# EAGLE design gerbang fix (EAGLE 6.6.0)
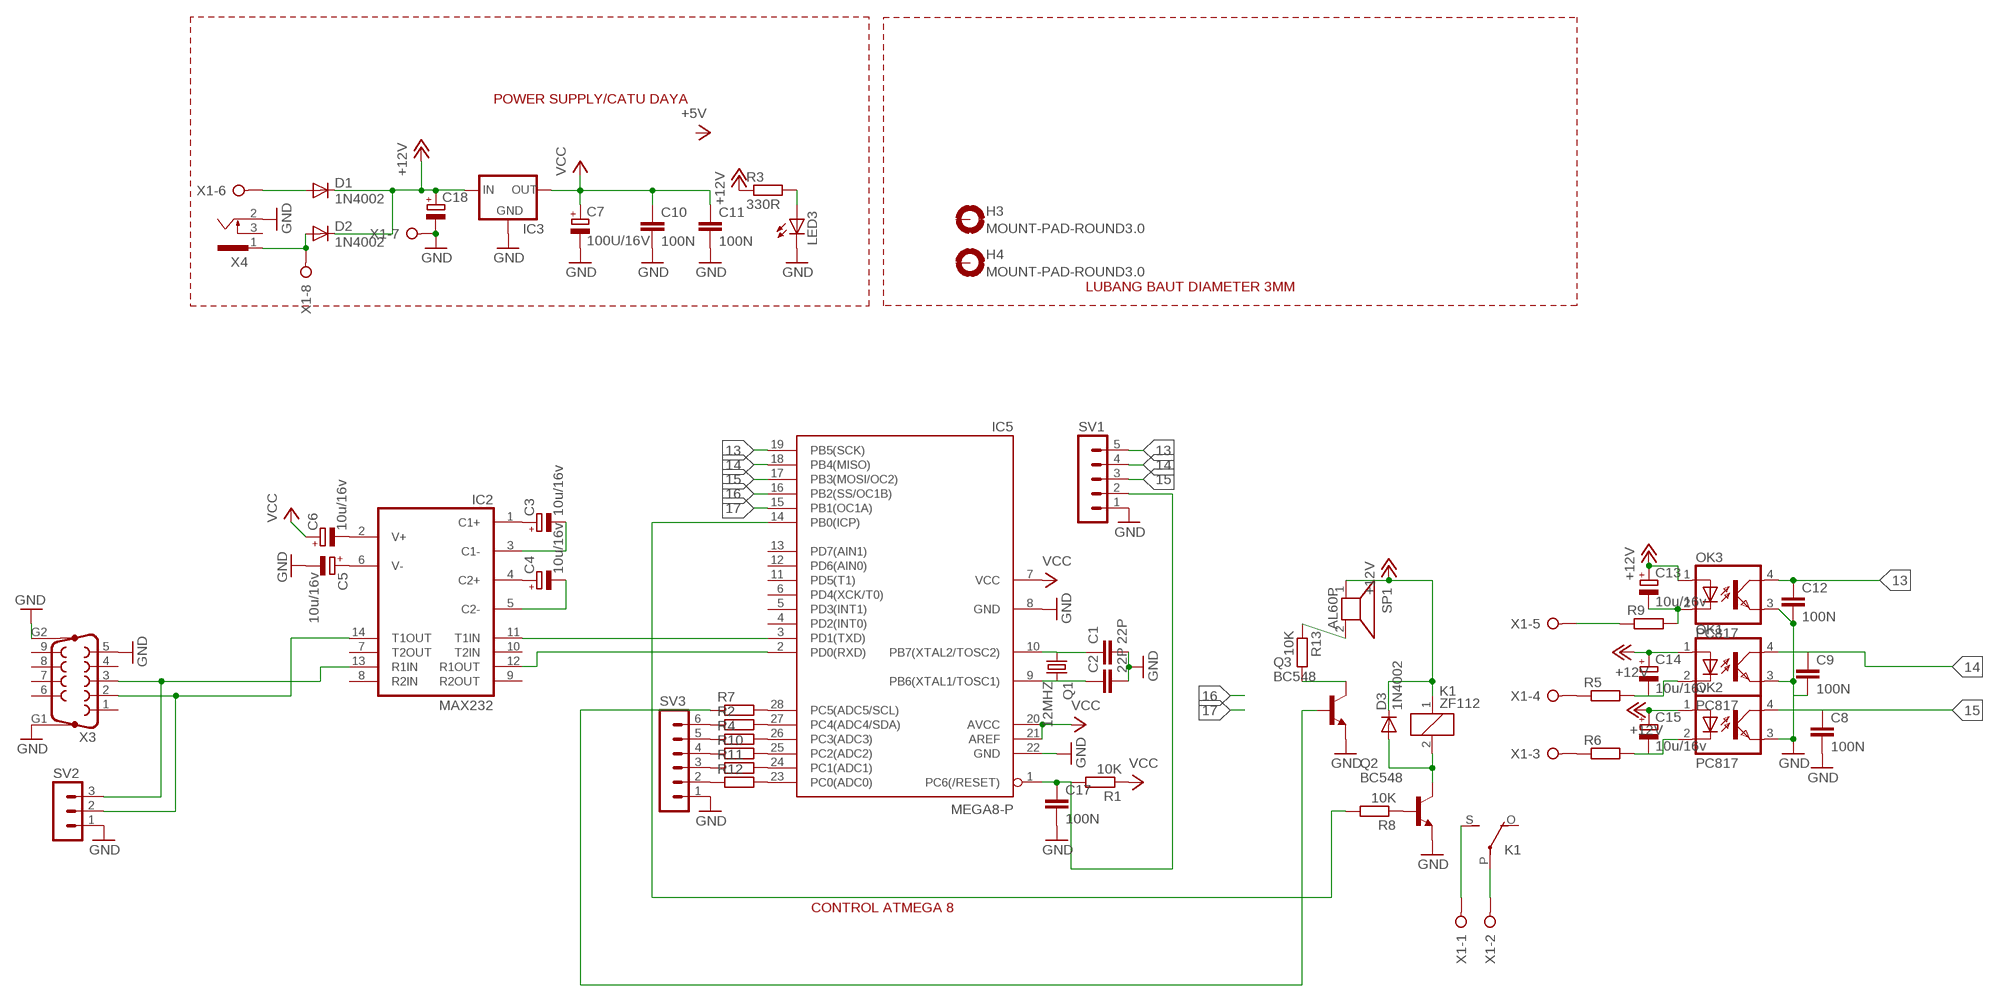
[diagram p0: schematic, sheet 1]

## Parts
C1  22P  C-EU025-025X050  [C025-025X050]
C2  22P  C-EU025-025X050  [C025-025X050]
C3  10u/16v  CPOL-EUE2.5-6  [E2,5-6]
C4  10u/16v  CPOL-EUE2.5-6  [E2,5-6]
C5  10u/16v  CPOL-EUE2.5-6  [E2,5-6]
C6  10u/16v  CPOL-EUE2.5-6  [E2,5-6]
C7  100U/16V  CPOL-EUE2.5-6  [E2,5-6]
C8  100N  C-EU025-025X050  [C025-025X050]
C9  100N  C-EU025-025X050  [C025-025X050]
C10  100N  C-EU025-025X050  [C025-025X050]
C11  100N  C-EU025-025X050  [C025-025X050]
C12  100N  C-EU025-025X050  [C025-025X050]
C13  10u/16v  CPOL-EUE2.5-6  [E2,5-6]
C14  10u/16v  CPOL-EUE2.5-6  [E2,5-6]
C15  10u/16v  CPOL-EUE2.5-6  [E2,5-6]
C17  100N  C-EU025-025X050  [C025-025X050]
C18  CPOL-EUE5-8.5  [E5-8,5]
D1  1N4002  1N4148DO35-10  [DO35-10]
D2  1N4002  1N4148DO35-10  [DO35-10]
D3  1N4002  1N4148DO35-10  [DO35-10]
H3  MOUNT-PAD-ROUND3.0  [3,0-PAD]
H4  MOUNT-PAD-ROUND3.0  [3,0-PAD]
IC2  MAX232  [DIL16]
IC3  78XXS  [78XXS]
IC5  MEGA8-P  [DIL28-3]
K1  ZF112  [ZF112]
LED3  LED5MM  [LED5MM]
OK1  PC817  [DIL04]
OK2  PC817  [DIL04]
OK3  PC817  [DIL04]
Q1  12MHZ  CRYSTALHC49U-V  [HC49U-V]
Q2  BC548  [TO92-EBC]
Q3  BC548  [TO92-EBC]
R1  10K  R-EU_0207/10  [0207/10]
R2  R-EU_0204/2V  [0204V]
R3  330R  R-EU_0207/10  [0207/10]
R4  R-EU_0204/2V  [0204V]
R5  R-EU_0204/2V  [0204V]
R6  R-EU_0204/2V  [0204V]
R7  R-EU_0204/2V  [0204V]
R8  10K  R-EU_0207/10  [0207/10]
R9  R-EU_0204/2V  [0204V]
R10  R-EU_0204/2V  [0204V]
R11  R-EU_0204/2V  [0204V]
R12  R-EU_0204/2V  [0204V]
R13  10K  R-EU_0207/10  [0207/10]
SP1  AL60P  [AL60P]
SV1  MA05-1  [MA05-1]
SV2  MA03-1  [MA03-1]
SV3  MA06-1  [MA06-1]
X1  W237-08P  [W237-8P]
X3  F09HP  [F09HP]
X4  733980-62  [733980-62]

## Nets
13: C12.1 IC5.19(PB5(SCK)) OK3.4(COL) SV1.5
14: C9.1 IC5.18(PB4(MISO)) OK1.4(COL) SV1.4
15: C8.1 IC5.17(PB3(MOSI/OC2)) OK2.4(COL) SV1.3
16: IC5.16(PB2(SS/OC1B))
17: IC5.15(PB1(OC1A))
+12V: C13.+ C14.+ C15.+ C18.+ D1.C D2.C D3.C IC3.IN K1.1 OK1.1(A) OK2.1(A) OK3.1(A) R3.1 SP1.1
GND: C1.2 C2.2 C5.- C7.- C8.2 C9.2 C10.2 C11.2 C12.2 C17.2 C18.- IC3.GND IC5.8(GND) IC5.22(GND) LED3.K(C) OK1.3(EMIT) OK2.3(EMIT) OK3.3(EMIT) Q2.E Q3.E SV1.1 SV2.1 SV3.1 X1.7 X3.5 X3.G1 X3.G2 X4.2
N$1: C17.1 IC5.1(PC6(/RESET)) R1.2 SV1.2
N$2: Q3.C R13.2
N$3: Q3.B R7.1
N$4: IC5.14(PB0(ICP)) R8.2
N$5: R13.1 SP1.2
N$8: R9.1 X1.5
N$9: D1.A X1.6
N$10: IC2.12(R1OUT) IC5.2(PD0(RXD))
N$11: IC2.11(T1IN) IC5.3(PD1(TXD))
N$12: C2.1 IC5.9(PB6(XTAL1/TOSC1)) Q1.2
N$13: C1.1 IC5.10(PB7(XTAL2/TOSC2)) Q1.1
N$14: LED3.A R3.2
N$15: R5.1 X1.4
N$16: C3.+ IC2.1(C1+)
N$17: C3.- IC2.3(C1-)
N$19: D2.A X1.8 X4.1
N$20: IC5.27(PC4(ADC4/SDA)) R2.2
N$21: R6.1 X1.3
N$22: C4.+ IC2.4(C2+)
N$23: C4.- IC2.5(C2-)
N$24: C5.+ IC2.6(V-)
N$25: C6.- IC2.2(V+)
N$26: IC2.13(R1IN) SV2.3 X3.3
N$27: IC2.14(T1OUT) SV2.2 X3.2
N$28: IC5.28(PC5(ADC5/SCL)) R7.2
N$29: K1.S(2:S) X1.1
N$30: K1.P(2:P) X1.2
N$31: C13.- OK3.2(C) R9.2
N$32: C14.- OK1.2(C) R5.2
N$33: C15.- OK2.2(C) R6.2
N$34: D3.A K1.2 Q2.C
N$35: IC5.26(PC3(ADC3)) R4.2
N$36: Q2.B R8.1
N$37: IC5.25(PC2(ADC2)) R10.2
N$38: IC5.24(PC1(ADC1)) R11.2
N$39: IC5.23(PC0(ADC0)) R12.2
N$40: R2.1 SV3.6
N$41: R4.1 SV3.5
N$42: R10.1 SV3.4
N$43: R11.1 SV3.3
N$44: R12.1 SV3.2
VCC: C6.+ C7.+ C10.1 C11.1 IC3.OUT IC5.7(VCC) IC5.20(AVCC) IC5.21(AREF) R1.1
Unconnected: H3.B3,0(MOUNT) H4.B3,0(MOUNT) IC2.7(T2OUT) IC2.8(R2IN) IC2.9(R2OUT) IC2.10(T2IN) IC5.4(PD2(INT0)) IC5.5(PD3(INT1)) IC5.6(PD4(XCK/T0)) IC5.11(PD5(T1)) IC5.12(PD6(AIN0)) IC5.13(PD7(AIN1)) K1.O(2:O) X3.1 X3.4 X3.6 X3.7 X3.8 X3.9 X4.3

## Notes on the sheet
- POWER SUPPLY/CATU DAYA
- LUBANG BAUT DIAMETER 3MM
- CONTROL ATMEGA 8

## Power pins joined to a net without a drawn wire
GND: IC2.15(GND)
VCC: IC2.16(VCC)

## Library data of the parts
C1 C2 C8-C12 C17 = resistor:C-EU: CAPACITOR, European symbol
C3-C7 C13-C15 = resistor:CPOL-EU: POLARIZED CAPACITOR, European symbol
C18 = rcl:CPOL-EU: POLARIZED CAPACITOR, European symbol
D1-D3 = diode:1N4148: DIODE high speed (Philips)
H3 H4 = holes:MOUNT-PAD-ROUND: MOUNTING PAD, round
IC2 = maxim:MAX232: RS232 TRANSEIVER; MF: MAXIM; MPN: MAX232ACPE+; OC_FARNELL: 9723773; OC_NEWARK: 68K4544
IC3 = v-reg:78XXS: VOLTAGE REGULATOR
IC5 = atmel:MEGA8-P: MICROCONTROLLER 8 Kbytes FLASH, 1 kbytes SRAM, 512 bytes EEPROM, USART, 4-channel 10 bit ADC, 2-channel 8 bit ADC Pin compatible with Atmega48, ATMega88, ATMega168 Source: avr.lbr; OC_FARNELL: unknown; OC_NEWARK: unknown
K1 = relay:ZF112: RELAY 1 x switch; OC_FARNELL: unknown; OC_NEWARK: unknown
LED3 = led:LED: LED OSRAM: - CHIPLED LG R971, LG N971, LY N971, LG Q971, LY Q971, LO R971, LY R971 LH N974, LH R974 LS Q976, LO Q976, LY Q976 LO Q996 - Hyper CHIPLED LW Q18S LB Q993, LB Q99A, LB R99A - SideLED LS A670, LO A670, LY A670, LG A670, LP A670 LB A673, LV A673, LT A673, LW A673 LH A674 LY A675 LS A676, LA A676, LO A676, LY A676, LW A676 LS A679, LY A679, LG A679 - Hyper Micro SIDELED® LS Y876, LA Y876, LO Y876, LY Y876 LT Y87S - SmartLED LW L88C, LW L88S LB L89C, LB L89S, LG L890 LS L89K, LO L89K, LY L89K LS L896, LA L896, LO L896, LY L896 - TOPLED LS T670, LO T670, LY T670, LG T670, LP T670 LSG T670, LSP T670, LSY T670, LOP T670, LYG T670 LG T671, LOG T671, LSG T671 LB T673, LV T673, LT T673, LW T673 LH T674 LS T676, LA T676, LO T676, LY T676, LB T676, LH T676, LSB T676, LW T676 LB T67C, LV T67C, LT T67C, LS T67K, LO T67K, LY T67K, LW E67C LS E67B, LA E67B, LO E67B, LY E67B, LB E67C, LV E67C, LT E67C LW T67C LS T679, LY T679, LG T679 LS T770, LO T770, LY T770, LG T770, LP T770 LB T773, LV T773, LT T773, LW T773 LH T774 LS E675, LA E675, LY E675, LS T675 LS T776, LA T776, LO T776, LY T776, LB T776 LHGB T686 LT T68C, LB T68C - Hyper Mini TOPLED® LB M676 - Mini TOPLED Santana® LG M470 LS M47K, LO M47K, LY M47K Source: http://www.osram.convergy.de LUXEON: - LUMILED® LXK2-PW12-R00, LXK2-PW12-S00, LXK2-PW14-U00, LXK2-PW14-V00 LXK2-PM12-R00, LXK2-PM12-S00, LXK2-PM14-U00 LXK2-PE12-Q00, LXK2-PE12-R00, LXK2-PE12-S00, LXK2-PE14-T00, LXK2-PE14-U00 LXK2-PB12-K00, LXK2-PB12-L00, LXK2-PB12-M00, LXK2-PB14-N00, LXK2-PB14-P00, LXK2-PB14-Q00 LXK2-PR12-L00, LXK2-PR12-M00, LXK2-PR14-Q00, LXK2-PR14-R00 LXK2-PD12-Q00, LXK2-PD12-R00, LXK2-PD12-S00 LXK2-PH12-R00, LXK2-PH12-S00 LXK2-PL12-P00, LXK2-PL12-Q00, LXK2-PL12-R00 Source: www.luxeon.com KINGBRIGHT: KA-3528ASYC Source: www.kingbright.com
OK1-OK3 = optocoupler:PC817: SHARP OPTO COUPLER; MPN: PC817X4J000F; OC_FARNELL: 9707727; OC_NEWARK: 97K7059
Q1 = crystal:CRYSTAL: CRYSTAL; OC_FARNELL: 1666969; OC_NEWARK: unknown
Q2 Q3 = transistor-npn:BC548*: NPN Transistor
R1 R3 R8 R13 = resistor:R-EU_: RESISTOR, European symbol
R2 R4-R7 R9-R12 = rcl:R-EU_: RESISTOR, European symbol
SP1 = buzzer:AL60P: SPEAKER Source: Buerklin; OC_FARNELL: unknown; OC_NEWARK: unknown
SV1 = con-lstb:MA05-1: PIN HEADER; OC_FARNELL: unknown; OC_NEWARK: unknown
SV2 = con-lstb:MA03-1: PIN HEADER; OC_FARNELL: unknown; OC_NEWARK: unknown
SV3 = con-lstb:MA06-1: PIN HEADER; OC_FARNELL: unknown; OC_NEWARK: unknown
X1 = con-wago-508:W237-08P: WAGO SREW CLAMP; OC_FARNELL: unknown; OC_NEWARK: unknown
X3 = con-subd:F09HP: SUB-D; OC_FARNELL: unknown; OC_NEWARK: unknown
X4 = con-conrad:73398?: FEMALE PRINT CONNECTOR Niedervolt-Steckverbinder Distributor Conrad

## Board
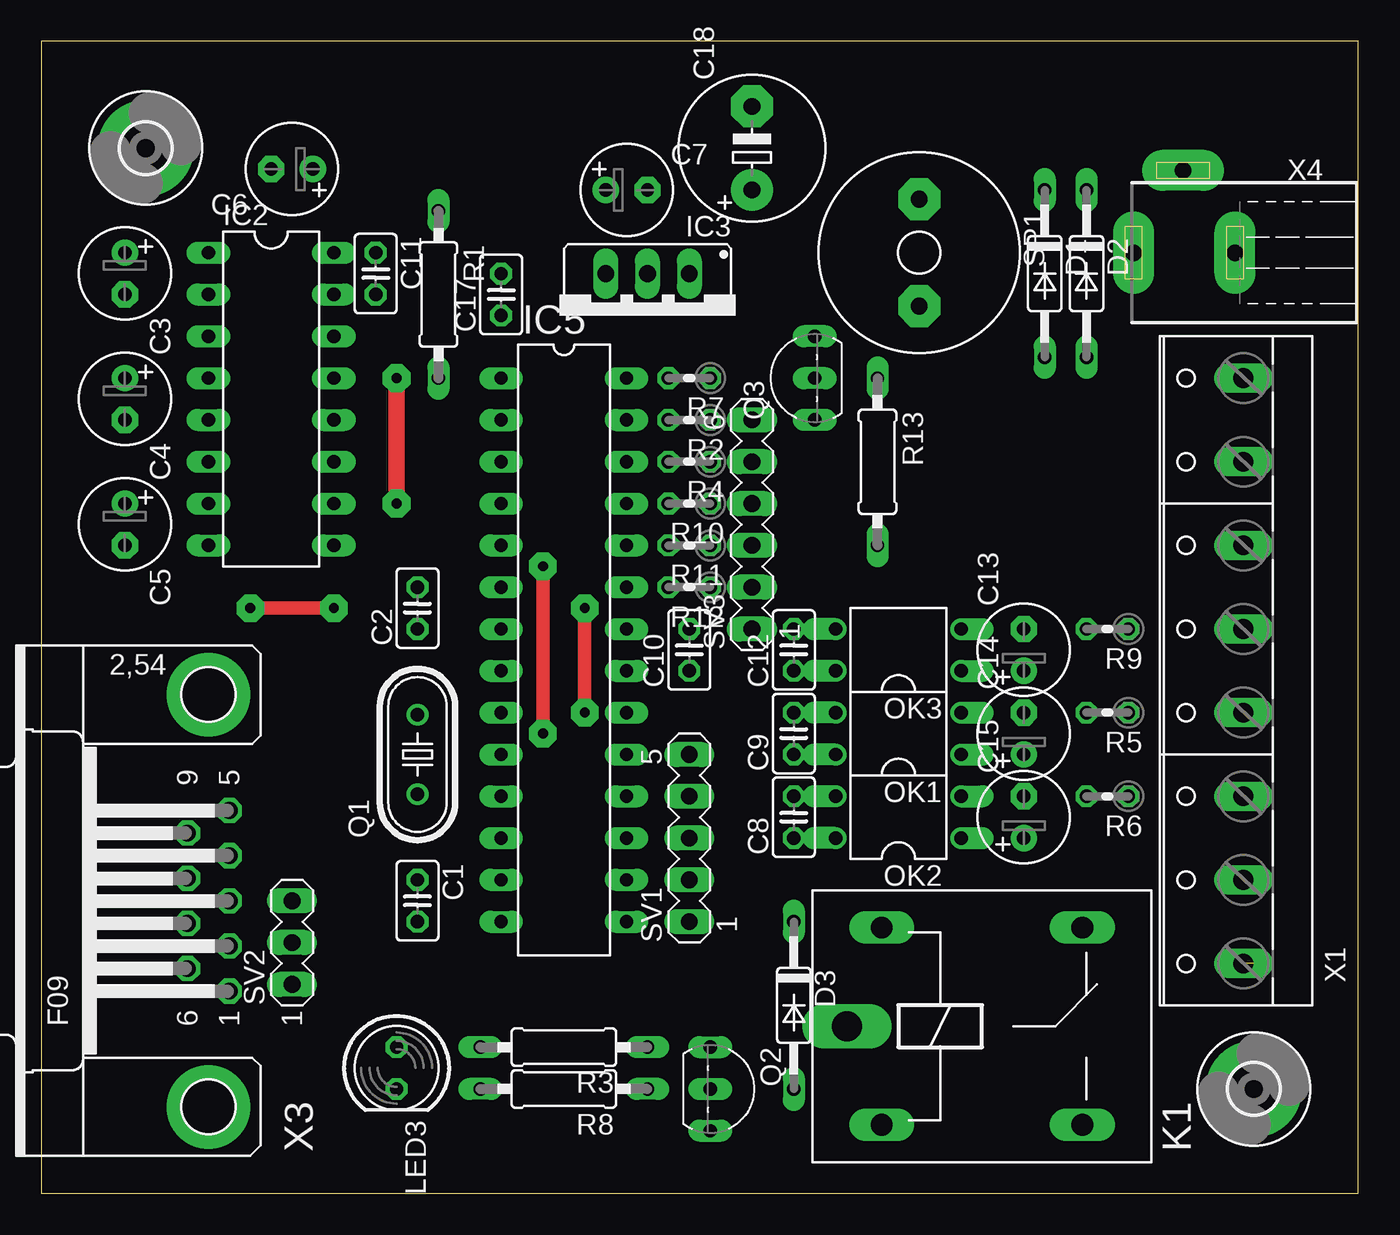
[diagram p1: board, top side]
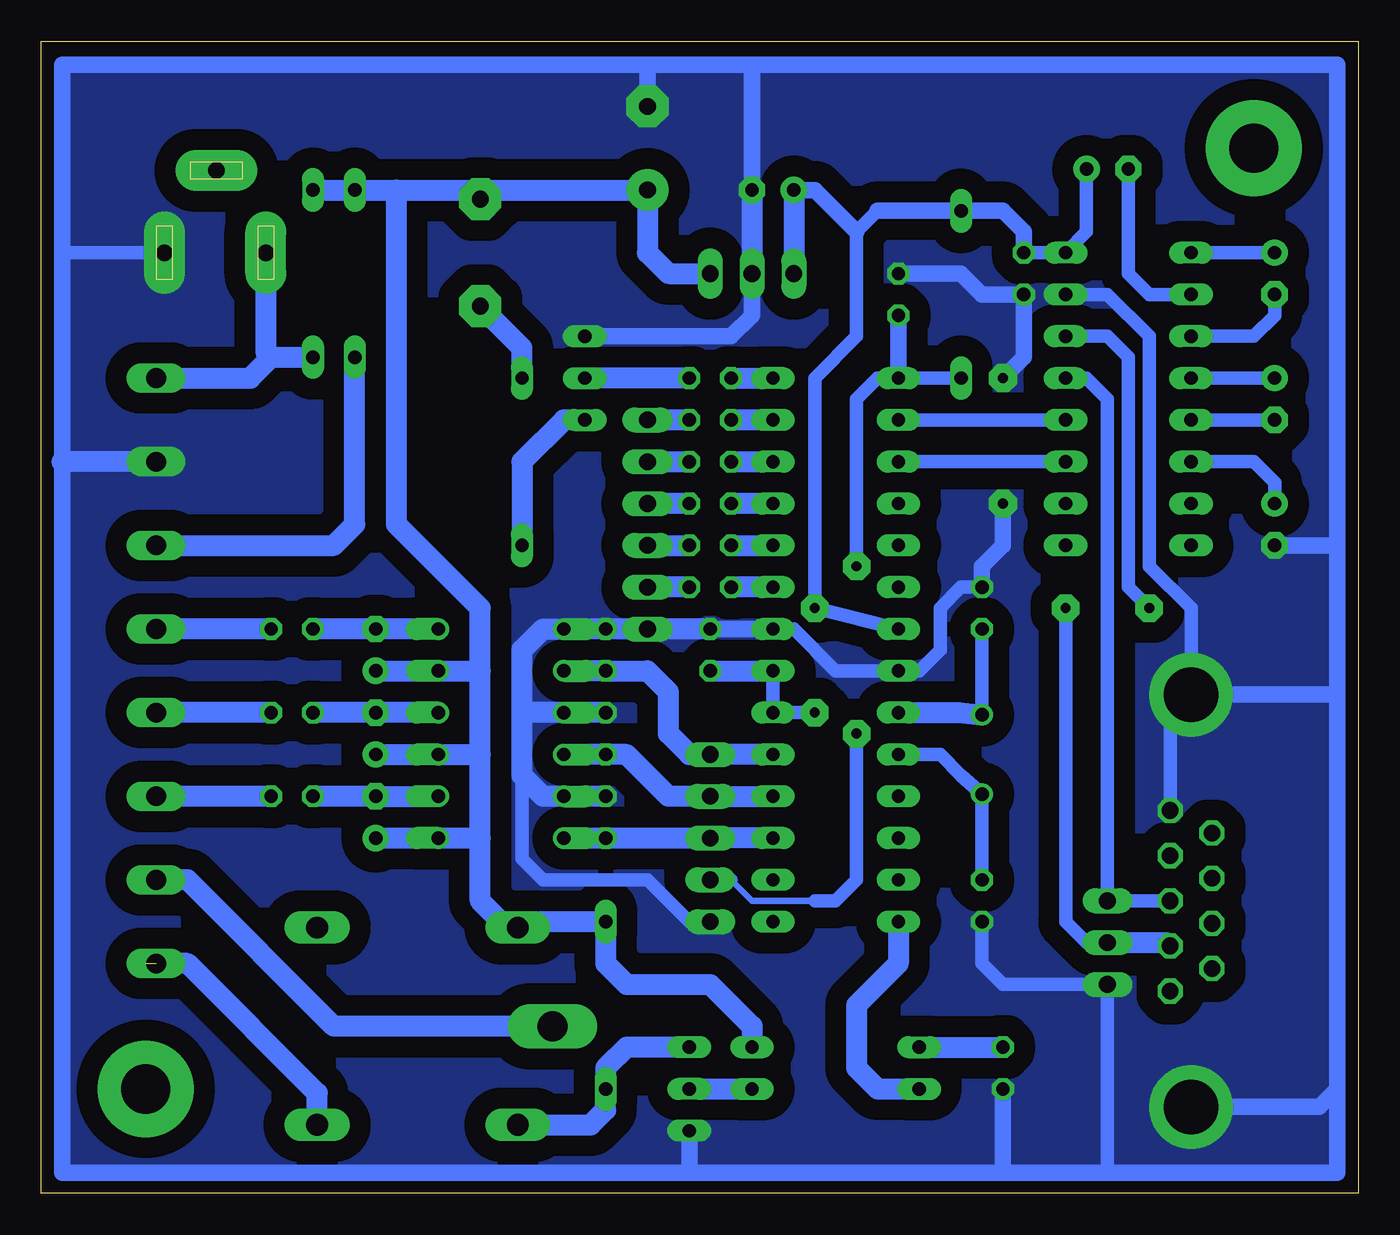
[diagram p2: board, bottom side, seen from below]

Size 80 x 70 mm. Coordinates in mm from the lower left corner, seen from the top.
Outline: 0,0 80,0 80,70 0,70 0,0
Copper layers (1*16): Top 0.035mm / dielectric 1.5mm / Bottom 0.035mm
Design rules "default": minimum track width 10mil, minimum drill 24mil, track to track 8mil, track to pad 8mil, pad to pad 8mil, via to via 8mil, smd to smd 8mil, copper to edge 40mil, drill to drill 8mil, minimum pad ring 10mil, minimum via ring 8mil, stop-mask expansion 4mil, vias tented up to drill 0mil, thermal gap 10mil

### Footprints (pad centres in the part's own frame; a part is rotated, then mirrored left to right if it is on the bottom)
C025-025X050 = drill 0.813 octagon: 1 -1.27,0; 2 1.27,0
E2,5-6 = drill 0.813 pad 1.6: + -1.27,0 | drill 0.813 pad 1.6 octagon: - 1.27,0
E5-8,5 = drill 1.016 pad 2.54: + -2.54,0 | drill 1.016 pad 2.54 octagon: - 2.54,0
DO35-10 = drill 0.813 long: A 5.08,0; C -5.08,0
3,0-PAD = drill 3 pad 5.842: B3,0 0,0
DIL16 = drill 0.813 long: 1 -8.89,-3.81; 2 -6.35,-3.81; 3 -3.81,-3.81; 4 -1.27,-3.81; 5 1.27,-3.81; 6 3.81,-3.81; 7 6.35,-3.81; 8 8.89,-3.81; 9 8.89,3.81; 10 6.35,3.81; 11 3.81,3.81; 12 1.27,3.81; 13 -1.27,3.81; 14 -3.81,3.81; 15 -6.35,3.81; 16 -8.89,3.81
78XXS = drill 1.016 long: GND 0,-2.54; IN -2.54,-2.54; OUT 2.54,-2.54
DIL28-3 = drill 0.813 long: 1 -16.51,-3.81; 2 -13.97,-3.81; 3 -11.43,-3.81; 4 -8.89,-3.81; 5 -6.35,-3.81; 6 -3.81,-3.81; 7 -1.27,-3.81; 8 1.27,-3.81; 9 3.81,-3.81; 10 6.35,-3.81; 11 8.89,-3.81; 12 11.43,-3.81; 13 13.97,-3.81; 14 16.51,-3.81; 15 16.51,3.81; 16 13.97,3.81; 17 11.43,3.81; 18 8.89,3.81; 19 6.35,3.81; 20 3.81,3.81; 21 1.27,3.81; 22 -1.27,3.81; 23 -3.81,3.81; 24 -6.35,3.81; 25 -8.89,3.81; 26 -11.43,3.81; 27 -13.97,3.81; 28 -16.51,3.81
ZF112 = drill 1.321 long: 1 -6.096,5.994; 2 -6.096,-5.994; O 6.096,5.994; S 6.096,-5.994 | drill 1.803 long: P -8.204,0
LED5MM = drill 0.813 octagon: A -1.27,0; K 1.27,0
DIL04 = drill 0.813 offset: 1 -1.27,-3.81; 2 1.27,-3.81; 3 1.27,3.81; 4 -1.27,3.81
HC49U-V = drill 0.813: 1 -2.413,0; 2 2.413,0
TO92-EBC = drill 0.813 long: B 0,-1.27; C -2.54,-1.27; E 2.54,-1.27
0207/10 = drill 0.813 long: 1 -5.08,0; 2 5.08,0
0204V = drill 0.813 octagon: 1 -1.27,0; 2 1.27,0
AL60P = drill 1.016 pad 2.54 octagon: 1 -3.251,0; 2 3.251,0
MA05-1 = drill 1.016 long: 1 -5.08,0; 2 -2.54,0; 3 0,0; 4 2.54,0; 5 5.08,0
MA03-1 = drill 1.016 long: 1 -2.54,0; 2 0,0; 3 2.54,0
MA06-1 = drill 1.016 long: 1 -6.35,0; 2 -3.81,0; 3 -1.27,0; 4 1.27,0; 5 3.81,0; 6 6.35,0
W237-8P = drill 1.194 long: 1 -17.78,-0.635; 2 -12.7,-0.635; 3 -7.62,-0.635; 4 -2.54,-0.635; 5 2.54,-0.635; 6 7.62,-0.635; 7 12.7,-0.635; 8 17.78,-0.635
F09HP = drill 1.016 octagon: 1 -5.486,-1.27; 2 -2.743,-1.27; 3 0,-1.27; 4 2.743,-1.27; 5 5.486,-1.27; 6 -4.115,1.27; 7 -1.372,1.27; 8 1.372,1.27; 9 4.115,1.27 | drill 3.302 pad 5.08: G1 -12.522,0; G2 12.522,0
733980-62 = drill 1 pad 2.5 long: 1 0,8.57; 2 0,2.42; 3 5,5.57

### Placement (x,y rotation side)
C1  22.86,17.78 270 top
C2  22.86,35.56 90 top
C3  5.08,55.88 270 top
C4  5.08,48.26 270 top
C5  5.08,40.64 270 top
C6  15.24,62.23 180 top
C7  35.56,60.96 0 top
C8  45.72,22.86 90 top
C9  45.72,27.94 90 top
C10  39.37,33.02 90 top
C11  20.32,55.88 270 top
C12  45.72,33.02 90 top
C13  59.69,33.02 90 top
C14  59.69,27.94 90 top
C15  59.69,22.86 90 top
C17  27.94,54.61 90 top
C18  43.18,63.5 90 top
D1  60.96,55.88 270 top
D2  63.5,55.88 270 top
D3  45.72,11.43 270 top
H3  6.35,63.5 0 top
H4  73.66,6.35 0 top
IC2  13.97,48.26 270 top
IC3  36.83,53.34 180 top
IC5  31.75,33.02 270 top
K1  57.15,10.16 0 top
LED3  21.59,7.62 270 top
OK1  52.07,27.94 90 top
OK2  52.07,22.86 90 top
OK3  52.07,33.02 90 top
Q1  22.86,26.67 90 top
Q2  41.91,6.35 270 top
Q3  45.72,49.53 90 top
R1  24.13,54.61 270 top
R2  39.37,46.99 180 top
R3  31.75,8.89 180 top
R4  39.37,44.45 180 top
R5  64.77,29.21 180 top
R6  64.77,24.13 180 top
R7  39.37,49.53 180 top
R8  31.75,6.35 180 top
R9  64.77,34.29 180 top
R10  39.37,41.91 180 top
R11  39.37,39.37 180 top
R12  39.37,36.83 180 top
R13  50.8,44.45 270 top
SP1  53.34,57.15 270 top
SV1  39.37,21.59 90 top
SV2  15.24,15.24 90 top
SV3  43.18,40.64 90 top
X1  72.39,31.75 90 top
X3  10.16,17.78 90 top
X4  74.93,57.15 90 top

### Tracks (layer width: path | path; a pad name or v marks a point on that pad's centre or on a via)
13
  Bottom 1.27: IC5.19 SV1.5 40.64,26.67 41.91,27.94 41.91,30.48 43.18,31.75 C12.1 OK3.4
14
  Bottom 1.27: IC5.18 SV1.4 41.91,24.13 44.45,26.67 C9.1 OK1.4
15
  Bottom 1.27: IC5.17 SV1.3 C8.1 OK2.4
+12V
  Bottom 1.27: D3.C 49.43,16.51 K1.1 | D1.C D2.C 58.42,60.96 | 58.42,60.96 53.34,60.96 | 53.34,60.96 C18.+ 43.18,57.15 41.91,55.88 IC3.IN | SP1.1 53.34,60.96 | D3.C 52.07,16.51 53.34,17.78 53.34,21.59 | 53.34,21.59 53.34,26.67 | 53.34,26.67 53.34,31.75 | 53.34,31.75 53.34,35.56 58.42,40.64 58.42,60.96 | C13.+ OK3.1 53.34,31.75 | OK1.1 C14.+ 53.34,26.67 | C15.+ OK2.1 53.34,21.59 | D3.C 45.72,13.97 44.45,12.7 39.37,12.7 36.83,10.16 R3.1
GND  (via drill 0.6 pad 1.68)
  Top 1.016: v21.59,49.53 v21.59,41.91
  Bottom 0.813: IC5.22 34.29,34.29 31.75,31.75 IC5.8 26.67,31.75 25.4,33.02 25.4,35.56 24.13,36.83 C2.2 | IC2.15 15.24,54.61 12.7,52.07 12.7,38.1 10.16,35.56 X3.G2 11.43,29.03 X3.5 | C1.2 22.86,13.97 21.59,12.7 SV2.1 15.24,1.27 | SV1.1 40.64,16.51 43.18,19.05 49.53,19.05 50.8,20.32 50.8,25.4 | X4.2 78.74,57.15
  Bottom 1.016: 36.83,68.58 1.27,68.58 1.27,39.37 | 36.83,68.58 43.18,68.58 | 43.18,68.58 78.74,68.58 78.74,57.15 78.74,44.45 78.74,1.27 40.64,1.27 | 1.27,6.35 1.27,1.27 15.24,1.27 21.59,1.27 | 1.27,6.35 1.27,30.48 | 1.27,30.48 1.27,39.37 | 21.59,1.27 40.64,1.27 | 1.27,39.37 C5.- | LED3.K 21.59,1.27 | Q2.E 40.64,1.27 | X3.G2 1.45,30.3 1.27,30.48 | X3.G1 2.36,5.26 1.27,6.35 | C17.2 24.13,55.88 22.86,54.61 C11.2 20.32,50.8 v21.59,49.53 | v21.59,41.91 21.59,39.37 22.86,38.1 C2.2 | C10.2 IC5.22 | C7.- 36.83,68.58 | C18.- 43.18,68.58 | Q3.E 38.1,52.07 36.83,53.34 IC3.GND
  Bottom 1.27: C9.2 OK1.3 50.8,29.21 | C8.2 OK2.3 49.53,24.13 50.8,25.4 50.8,29.21 | C7.- IC3.GND | C10.2 SV3.1 C12.2 OK3.3 49.53,34.29 50.8,33.02 50.8,29.21 | X1.7 78.74,44.45
  pour Bottom (isolate 1.27, no thermals): 0,70 80.16,70 80.01,0 0,0
N$1  (via drill 0.6 pad 1.68)
  Top 0.813: v30.48,38.1 v30.48,27.94
  Bottom 0.406: 33.02,17.78 36.83,17.78 38.1,19.05
  Bottom 0.813: R1.2 IC5.1 29.21,49.53 30.48,48.26 v30.48,38.1 | v30.48,27.94 30.48,19.05 31.75,17.78 33.02,17.78 | 38.1,19.05 SV1.2
  Bottom 1.016: C17.1 IC5.1
N$2
  Bottom 1.27: Q3.C 48.26,46.99 50.8,44.45 R13.2
N$3
  Bottom 1.27: R7.1 Q3.B
N$4
  Bottom 1.27: IC5.14 27.94,13.97 30.48,11.43 30.48,7.62 29.21,6.35 R8.2
N$5
  Bottom 1.27: R13.1 50.8,51.36 SP1.2
N$8
  Bottom 1.27: R9.1 X1.5
N$9
  Bottom 1.27: X1.6 62.23,39.37 60.96,40.64 D1.A
N$10
  Bottom 0.813: IC2.12 IC5.2
N$11
  Bottom 0.813: IC5.3 IC2.11
N$12
  Bottom 0.813: Q1.2 C2.1
  Bottom 1.27: IC5.9 24.26,29.21 Q1.2
N$13
  Bottom 0.813: IC5.10 25.4,26.67 24.13,25.4 Q1.1 C1.1
N$14
  Bottom 1.27: R3.2 LED3.A
N$15
  Bottom 1.27: R5.1 X1.4
N$16
  Bottom 0.813: C3.+ IC2.1
N$17
  Bottom 0.813: C3.- 5.08,53.34 6.35,52.07 IC2.3
N$19
  Bottom 1.27: X1.8 67.31,49.53 66.04,50.8 | 66.04,50.8 D2.A | X4.1 66.36,51.12 66.04,50.8
N$20
  Bottom 1.27: IC5.27 R2.2
N$21
  Bottom 1.27: R6.1 X1.3
N$22
  Bottom 0.813: C4.+ IC2.4
N$23
  Bottom 0.813: C4.- IC2.5
N$24
  Bottom 0.813: C5.+ 5.08,43.18 6.35,44.45 IC2.6
N$25
  Bottom 0.813: IC2.2 12.7,54.61 13.97,55.88 C6.-
N$26
  Bottom 0.813: IC2.13 16.51,49.53 15.24,48.26 SV2.3 X3.3
N$27  (via drill 0.6 pad 1.68)
  Top 0.813: v12.7,35.56 v17.78,35.56
  Bottom 0.813: IC2.14 15.24,52.07 13.97,50.8 13.97,36.83 v12.7,35.56 | v17.78,35.56 17.78,16.51 16.51,15.24 SV2.2
  Bottom 1.27: SV2.2 11.63,15.24 X3.2
N$28
  Bottom 1.27: R7.2 IC5.28
N$29  (1 unrouted)
  Bottom 1.27: K1.S 63.25,6.1 71.12,13.97 73.66,13.97
N$30
  Bottom 1.27: K1.P 62.23,10.16 71.12,19.05 X1.2
N$31
  Bottom 1.27: OK3.2 C13.- R9.2
N$32
  Bottom 1.27: OK1.2 C14.- R5.2
N$33
  Bottom 1.27: OK2.2 C15.- R6.2
N$34
  Bottom 1.27: Q2.C 44.45,8.89 45.72,7.62 D3.A 45.72,5.08 46.63,4.17 K1.2
N$35
  Bottom 1.27: R4.2 IC5.26
N$36
  Bottom 1.27: Q2.B R8.1
N$37
  Bottom 1.27: IC5.25 R10.2
N$38
  Bottom 1.27: R11.2 IC5.24
N$39
  Bottom 1.27: IC5.23 R12.2
N$40
  Bottom 1.27: R2.1 SV3.6
N$41
  Bottom 1.27: SV3.5 R4.1
N$42
  Bottom 1.27: R10.1 SV3.4
N$43
  Bottom 1.27: SV3.3 R11.1
N$44
  Bottom 1.27: R12.1 SV3.2
VCC  (via drill 0.6 pad 1.68)
  Top 0.813: v33.02,35.56 v33.02,29.21
  Bottom 0.813: C6.+ 16.51,58.42 IC2.16 C11.1 | IC5.7 v33.02,35.56 33.02,49.53 30.48,52.07 30.48,58.42 29.21,59.69 | IC5.21 IC5.20 v33.02,29.21
  Bottom 1.016: C11.1 20.32,58.42 21.59,59.69 R1.1 29.21,59.69 | C7.+ 33.02,60.96 30.48,58.42
  Bottom 1.27: C7.+ IC3.OUT | C10.1 IC5.21